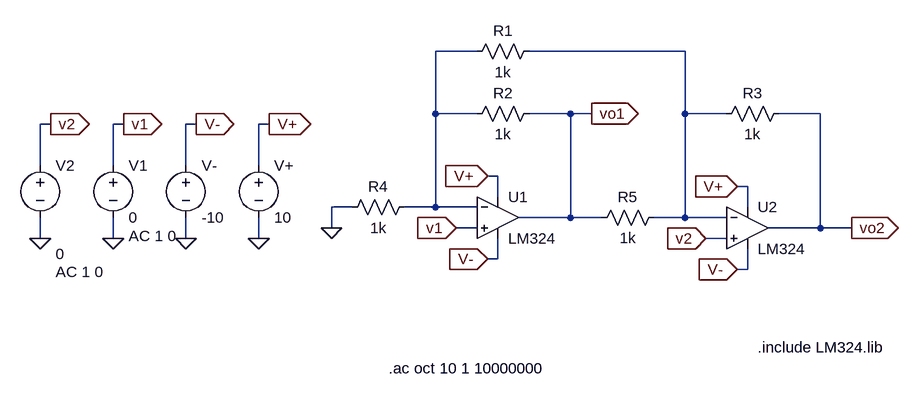
[diagram p0: schematic TP1_C1.asc]
TP1_C1.asc, the LTspice schematic file:
Version 4.1
SHEET 1 880 808
WIRE -80 -128 -144 -128
WIRE 240 -128 0 -128
WIRE -144 -32 -144 -128
WIRE -80 -32 -144 -32
WIRE 64 -32 0 -32
WIRE 96 -32 64 -32
WIRE 240 -32 240 -128
WIRE 304 -32 240 -32
WIRE 448 -32 384 -32
WIRE -736 -16 -752 -16
WIRE -624 -16 -640 -16
WIRE -512 -16 -528 -16
WIRE -400 -16 -416 -16
WIRE -752 48 -752 -16
WIRE -640 48 -640 -16
WIRE -528 48 -528 -16
WIRE -416 48 -416 -16
WIRE -48 64 -64 64
WIRE 336 80 320 80
WIRE -48 96 -48 64
WIRE -272 112 -304 112
WIRE -144 112 -144 -32
WIRE -144 112 -192 112
WIRE -80 112 -144 112
WIRE 336 112 336 80
WIRE 64 128 64 -32
WIRE 64 128 -16 128
WIRE 112 128 64 128
WIRE 240 128 240 -32
WIRE 240 128 192 128
WIRE 304 128 240 128
WIRE -304 144 -304 112
WIRE -80 144 -112 144
WIRE 448 144 448 -32
WIRE 448 144 368 144
WIRE 496 144 448 144
WIRE -752 160 -752 128
WIRE -640 160 -640 128
WIRE -528 160 -528 128
WIRE -416 160 -416 128
WIRE 304 160 272 160
WIRE -48 192 -48 160
WIRE -48 192 -64 192
WIRE 336 208 336 176
WIRE 336 208 320 208
FLAG -304 144 0
FLAG 96 -32 vo1
IOPIN 96 -32 Out
FLAG 496 144 vo2
IOPIN 496 144 Out
FLAG -112 144 v1
IOPIN -112 144 In
FLAG 272 160 v2
IOPIN 272 160 In
FLAG -64 64 V+
IOPIN -64 64 In
FLAG 320 80 V+
IOPIN 320 80 In
FLAG -64 192 V-
IOPIN -64 192 In
FLAG 320 208 V-
IOPIN 320 208 In
FLAG -400 -16 V+
IOPIN -400 -16 Out
FLAG -416 160 0
FLAG -512 -16 V-
IOPIN -512 -16 Out
FLAG -528 160 0
FLAG -624 -16 v1
IOPIN -624 -16 Out
FLAG -640 160 0
FLAG -736 -16 v2
IOPIN -736 -16 Out
FLAG -752 160 0
SYMBOL OpAmps\\opamp2 -48 64 R0
SYMATTR InstName U1
SYMATTR Value LM324
SYMBOL OpAmps\\opamp2 336 80 R0
SYMATTR InstName U2
SYMATTR Value LM324
SYMBOL res 208 112 R90
WINDOW 0 0 56 VBottom 2
WINDOW 3 32 56 VTop 2
SYMATTR InstName R5
SYMATTR Value 1k
SYMBOL res 16 -48 R90
WINDOW 0 0 56 VBottom 2
WINDOW 3 32 56 VTop 2
SYMATTR InstName R2
SYMATTR Value 1k
SYMBOL res 16 -144 R90
WINDOW 0 0 56 VBottom 2
WINDOW 3 32 56 VTop 2
SYMATTR InstName R1
SYMATTR Value 1k
SYMBOL res 400 -48 R90
WINDOW 0 0 56 VBottom 2
WINDOW 3 32 56 VTop 2
SYMATTR InstName R3
SYMATTR Value 1k
SYMBOL res -176 96 R90
WINDOW 0 0 56 VBottom 2
WINDOW 3 32 56 VTop 2
SYMATTR InstName R4
SYMATTR Value 1k
SYMBOL voltage -416 32 R0
WINDOW 123 0 0 Left 0
WINDOW 39 0 0 Left 0
SYMATTR InstName V+
SYMATTR Value 10
SYMBOL voltage -528 32 R0
WINDOW 123 0 0 Left 0
WINDOW 39 0 0 Left 0
SYMATTR InstName V-
SYMATTR Value -10
SYMBOL voltage -640 32 R0
WINDOW 123 24 124 Left 2
WINDOW 39 0 0 Left 0
SYMATTR InstName V1
SYMATTR Value 0
SYMATTR Value2 AC 1 0
SYMBOL voltage -752 32 R0
WINDOW 3 24 152 Left 2
WINDOW 123 24 180 Left 2
WINDOW 39 0 0 Left 0
SYMATTR InstName V2
SYMATTR Value 0
SYMATTR Value2 AC 1 0
TEXT 352 328 Left 2 !.include LM324.lib
TEXT -216 360 Left 2 !.ac oct 10 1 10000000

The netlist it stands for:
* TP1_C1.asc
X§U1 v1 N001 V+ V- vo1 LM324  ; pins In+ In- V+ V- OUT
X§U2 v2 N002 V+ V- vo2 LM324  ; pins In+ In- V+ V- OUT
R5 N002 vo1 1k
R2 vo1 N001 1k
R1 N002 N001 1k
R3 vo2 N002 1k
R4 N001 0 1k
V+ V+ 0 10
V- V- 0 -10
V1 v1 0 0 AC 1 0
V2 v2 0 0 AC 1 0
.include LM324.lib
.ac oct 10 1 10000000
.backanno
.end